# Altium schematic sheet ECAL-TEST-LEFT-ISOLATION.SchDoc
size A; SheetNumber: 2; SheetTotal: 5
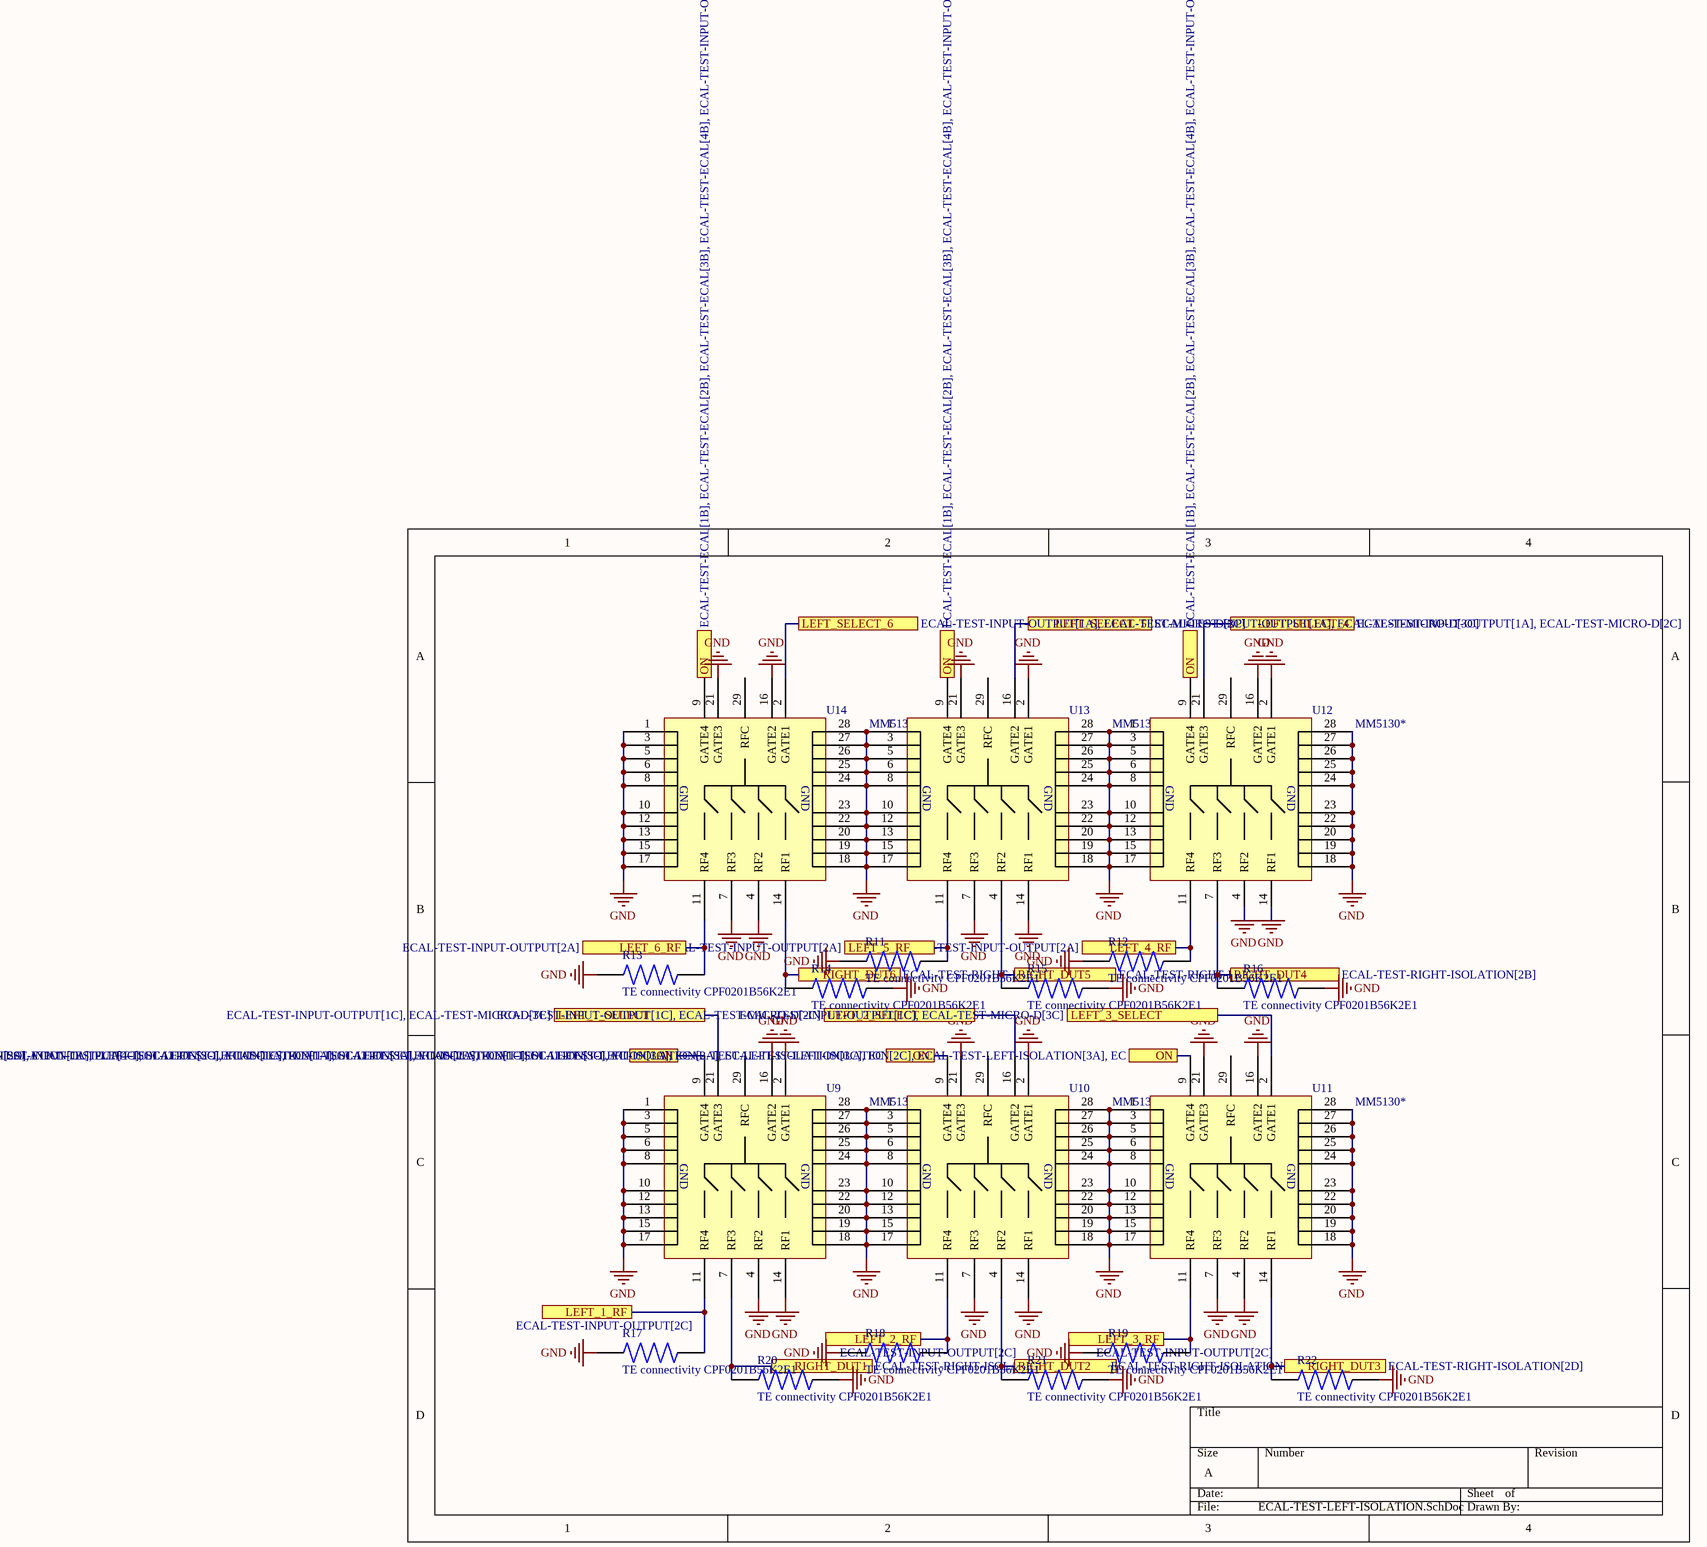
[diagram p0: ECAL-TEST-LEFT-ISOLATION.SchDoc]

## Parts
R11  TE connectivity CPF0201B56K2E1  [0201-resistor]
R12  TE connectivity CPF0201B56K2E1  [0201-resistor]
R13  TE connectivity CPF0201B56K2E1  [0201-resistor]
R14  TE connectivity CPF0201B56K2E1  [0201-resistor]
R15  TE connectivity CPF0201B56K2E1  [0201-resistor]
R16  TE connectivity CPF0201B56K2E1  [0201-resistor]
R17  TE connectivity CPF0201B56K2E1  [0201-resistor]
R18  TE connectivity CPF0201B56K2E1  [0201-resistor]
R19  TE connectivity CPF0201B56K2E1  [0201-resistor]
R20  TE connectivity CPF0201B56K2E1  [0201-resistor]
R21  TE connectivity CPF0201B56K2E1  [0201-resistor]
R22  TE connectivity CPF0201B56K2E1  [0201-resistor]
U9  MM5130*  [MM5130-NORM_PCB_NOFLOOD]
U10  MM5130*  [MM5130-NORM_PCB_NOFLOOD]
U11  MM5130*  [MM5130-NORM_PCB_NOFLOOD]
U12  MM5130*  [MM5130-NORM_PCB_NOFLOOD]
U13  MM5130*  [MM5130-NORM_PCB_NOFLOOD]
U14  MM5130*  [MM5130-NORM_PCB_NOFLOOD]

## Ports
LEFT_1_RF (see ECAL-TEST-INPUT-OUTPUT[2C]), LEFT_1_SELECT (see ECAL-TEST-INPUT-OUTPUT[1C], ECAL-TEST-MICRO-D[3C]), LEFT_2_RF (see ECAL-TEST-INPUT-OUTPUT[2C]), LEFT_2_SELECT (see ECAL-TEST-INPUT-OUTPUT[1C], ECAL-TEST-MICRO-D[2C]), LEFT_3_RF (see ECAL-TEST-INPUT-OUTPUT[2C]), LEFT_3_SELECT (see ECAL-TEST-INPUT-OUTPUT[1C], ECAL-TEST-MICRO-D[3C]), LEFT_4_RF (see ECAL-TEST-INPUT-OUTPUT[2A]), LEFT_5_RF (see ECAL-TEST-INPUT-OUTPUT[2A]), LEFT_6_RF (see ECAL-TEST-INPUT-OUTPUT[2A]), LEFT_SELECT_4 (see ECAL-TEST-INPUT-OUTPUT[1A], ECAL-TEST-MICRO-D[2C]), LEFT_SELECT_5 (see ECAL-TEST-INPUT-OUTPUT[1A], ECAL-TEST-MICRO-D[3C]), LEFT_SELECT_6 (see ECAL-TEST-INPUT-OUTPUT[1A], ECAL-TEST-MICRO-D[2C]), ON (see ECAL-TEST-ECAL[1B], ECAL-TEST-ECAL[2B], ECAL-TEST-ECAL[3B], ECAL-TEST-ECAL[4B], ECAL-TEST-INPUT-OUTPUT[1A], ECAL-TEST-INPUT-OUTPUT[1C], ECAL-TEST-INPUT-OUTPUT[2B], ECAL-TEST-INPUT-OUTPUT[3B], ECAL-TEST-INPUT-OUTPUT[4A], ECAL-TEST-INPUT-OUTPUT[4C], ECAL-TEST-LEFT-ISOLATION[1A], ECAL-TEST-LEFT-ISOLATION[1C], ECAL-TEST-LEFT-ISOLATION[2A], ECAL-TEST-LEFT-ISOLATION[2C], ECAL-TEST-LEFT-ISOLATION[3A], ECAL-TEST-MICRO-D[2C], ECAL-TEST-RIGHT-ISOLATION[2A], ECAL-TEST-RIGHT-ISOLATION[2C], ECAL-TEST-RIGHT-ISOLATION[3A], ECAL-TEST-RIGHT-ISOLATION[3C]), ON (see ECAL-TEST-ECAL[1B], ECAL-TEST-ECAL[2B], ECAL-TEST-ECAL[3B], ECAL-TEST-ECAL[4B], ECAL-TEST-INPUT-OUTPUT[1A], ECAL-TEST-INPUT-OUTPUT[1C], ECAL-TEST-INPUT-OUTPUT[2B], ECAL-TEST-INPUT-OUTPUT[3B], ECAL-TEST-INPUT-OUTPUT[4A], ECAL-TEST-INPUT-OUTPUT[4C], ECAL-TEST-LEFT-ISOLATION[1A], ECAL-TEST-LEFT-ISOLATION[1C], ECAL-TEST-LEFT-ISOLATION[2A], ECAL-TEST-LEFT-ISOLATION[2C], ECAL-TEST-LEFT-ISOLATION[3C], ECAL-TEST-MICRO-D[2C], ECAL-TEST-RIGHT-ISOLATION[2A], ECAL-TEST-RIGHT-ISOLATION[2C], ECAL-TEST-RIGHT-ISOLATION[3A], ECAL-TEST-RIGHT-ISOLATION[3C]), ON (see ECAL-TEST-ECAL[1B], ECAL-TEST-ECAL[2B], ECAL-TEST-ECAL[3B], ECAL-TEST-ECAL[4B], ECAL-TEST-INPUT-OUTPUT[1A], ECAL-TEST-INPUT-OUTPUT[1C], ECAL-TEST-INPUT-OUTPUT[2B], ECAL-TEST-INPUT-OUTPUT[3B], ECAL-TEST-INPUT-OUTPUT[4A], ECAL-TEST-INPUT-OUTPUT[4C], ECAL-TEST-LEFT-ISOLATION[1A], ECAL-TEST-LEFT-ISOLATION[1C], ECAL-TEST-LEFT-ISOLATION[2A], ECAL-TEST-LEFT-ISOLATION[3A], ECAL-TEST-LEFT-ISOLATION[3C], ECAL-TEST-MICRO-D[2C], ECAL-TEST-RIGHT-ISOLATION[2A], ECAL-TEST-RIGHT-ISOLATION[2C], ECAL-TEST-RIGHT-ISOLATION[3A], ECAL-TEST-RIGHT-ISOLATION[3C]), ON (see ECAL-TEST-ECAL[1B], ECAL-TEST-ECAL[2B], ECAL-TEST-ECAL[3B], ECAL-TEST-ECAL[4B], ECAL-TEST-INPUT-OUTPUT[1A], ECAL-TEST-INPUT-OUTPUT[1C], ECAL-TEST-INPUT-OUTPUT[2B], ECAL-TEST-INPUT-OUTPUT[3B], ECAL-TEST-INPUT-OUTPUT[4A], ECAL-TEST-INPUT-OUTPUT[4C], ECAL-TEST-LEFT-ISOLATION[1A], ECAL-TEST-LEFT-ISOLATION[1C], ECAL-TEST-LEFT-ISOLATION[2C], ECAL-TEST-LEFT-ISOLATION[3A], ECAL-TEST-LEFT-ISOLATION[3C], ECAL-TEST-MICRO-D[2C], ECAL-TEST-RIGHT-ISOLATION[2A], ECAL-TEST-RIGHT-ISOLATION[2C], ECAL-TEST-RIGHT-ISOLATION[3A], ECAL-TEST-RIGHT-ISOLATION[3C]), ON (see ECAL-TEST-ECAL[1B], ECAL-TEST-ECAL[2B], ECAL-TEST-ECAL[3B], ECAL-TEST-ECAL[4B], ECAL-TEST-INPUT-OUTPUT[1A], ECAL-TEST-INPUT-OUTPUT[1C], ECAL-TEST-INPUT-OUTPUT[2B], ECAL-TEST-INPUT-OUTPUT[3B], ECAL-TEST-INPUT-OUTPUT[4A], ECAL-TEST-INPUT-OUTPUT[4C], ECAL-TEST-LEFT-ISOLATION[1A], ECAL-TEST-LEFT-ISOLATION[2A], ECAL-TEST-LEFT-ISOLATION[2C], ECAL-TEST-LEFT-ISOLATION[3A], ECAL-TEST-LEFT-ISOLATION[3C], ECAL-TEST-MICRO-D[2C], ECAL-TEST-RIGHT-ISOLATION[2A], ECAL-TEST-RIGHT-ISOLATION[2C], ECAL-TEST-RIGHT-ISOLATION[3A], ECAL-TEST-RIGHT-ISOLATION[3C]), ON (see ECAL-TEST-ECAL[1B], ECAL-TEST-ECAL[2B], ECAL-TEST-ECAL[3B], ECAL-TEST-ECAL[4B], ECAL-TEST-INPUT-OUTPUT[1A], ECAL-TEST-INPUT-OUTPUT[1C], ECAL-TEST-INPUT-OUTPUT[2B], ECAL-TEST-INPUT-OUTPUT[3B], ECAL-TEST-INPUT-OUTPUT[4A], ECAL-TEST-INPUT-OUTPUT[4C], ECAL-TEST-LEFT-ISOLATION[1C], ECAL-TEST-LEFT-ISOLATION[2A], ECAL-TEST-LEFT-ISOLATION[2C], ECAL-TEST-LEFT-ISOLATION[3A], ECAL-TEST-LEFT-ISOLATION[3C], ECAL-TEST-MICRO-D[2C], ECAL-TEST-RIGHT-ISOLATION[2A], ECAL-TEST-RIGHT-ISOLATION[2C], ECAL-TEST-RIGHT-ISOLATION[3A], ECAL-TEST-RIGHT-ISOLATION[3C]), RIGHT_DUT1 (see ECAL-TEST-RIGHT-ISOLATION[3D]), RIGHT_DUT2 (see ECAL-TEST-RIGHT-ISOLATION[3D]), RIGHT_DUT3 (see ECAL-TEST-RIGHT-ISOLATION[2D]), RIGHT_DUT4 (see ECAL-TEST-RIGHT-ISOLATION[2B]), RIGHT_DUT5 (see ECAL-TEST-RIGHT-ISOLATION[3B]), RIGHT_DUT6 (see ECAL-TEST-RIGHT-ISOLATION[3B])

## Nets
GND: R11.1 R12.1 R13.1 R14.1 R15.1 R16.1 R17.1 R18.1 R19.1 R20.1 R21.1 R22.1 U9.1(GND) U9.2(GATE1) U9.3(GND) U9.4(RF2) U9.5(GND) U9.6(GND) U9.8(GND) U9.10(GND) U9.12(GND) U9.13(GND) U9.14(RF1) U9.15(GND) U9.16(GATE2) U9.17(GND) U9.18(GND) U9.19(GND) U9.20(GND) U9.22(GND) U9.23(GND) U9.24(GND) U9.25(GND) U9.26(GND) U9.27(GND) U9.28(GND) U10.1(GND) U10.2(GATE1) U10.3(GND) U10.5(GND) U10.6(GND) U10.7(RF3) U10.8(GND) U10.10(GND) U10.12(GND) U10.13(GND) U10.14(RF1) U10.15(GND) U10.17(GND) U10.18(GND) U10.19(GND) U10.20(GND) U10.21(GATE3) U10.22(GND) U10.23(GND) U10.24(GND) U10.25(GND) U10.26(GND) U10.27(GND) U10.28(GND) U11.1(GND) U11.3(GND) U11.4(RF2) U11.5(GND) U11.6(GND) U11.7(RF3) U11.8(GND) U11.10(GND) U11.12(GND) U11.13(GND) U11.15(GND) U11.16(GATE2) U11.17(GND) U11.18(GND) U11.19(GND) U11.20(GND) U11.21(GATE3) U11.22(GND) U11.23(GND) U11.24(GND) U11.25(GND) U11.26(GND) U11.27(GND) U11.28(GND) U12.1(GND) U12.2(GATE1) U12.3(GND) U12.4(RF2) U12.5(GND) U12.6(GND) U12.8(GND) U12.10(GND) U12.12(GND) U12.13(GND) U12.14(RF1) U12.15(GND) U12.16(GATE2) U12.17(GND) U12.18(GND) U12.19(GND) U12.20(GND) U12.22(GND) U12.23(GND) U12.24(GND) U12.25(GND) U12.26(GND) U12.27(GND) U12.28(GND) U13.1(GND) U13.2(GATE1) U13.3(GND) U13.5(GND) U13.6(GND) U13.7(RF3) U13.8(GND) U13.10(GND) U13.12(GND) U13.13(GND) U13.14(RF1) U13.15(GND) U13.17(GND) U13.18(GND) U13.19(GND) U13.20(GND) U13.21(GATE3) U13.22(GND) U13.23(GND) U13.24(GND) U13.25(GND) U13.26(GND) U13.27(GND) U13.28(GND) U14.1(GND) U14.3(GND) U14.4(RF2) U14.5(GND) U14.6(GND) U14.7(RF3) U14.8(GND) U14.10(GND) U14.12(GND) U14.13(GND) U14.15(GND) U14.16(GATE2) U14.17(GND) U14.18(GND) U14.19(GND) U14.20(GND) U14.21(GATE3) U14.22(GND) U14.23(GND) U14.24(GND) U14.25(GND) U14.26(GND) U14.27(GND) U14.28(GND)
LEFT_1_RF: R17.2 U9.11(RF4) ; port LEFT_1_RF
LEFT_1_SELECT: U9.21(GATE3) ; port LEFT_1_SELECT
LEFT_2_RF: R18.2 U10.11(RF4) ; port LEFT_2_RF
LEFT_2_SELECT: U10.16(GATE2) ; port LEFT_2_SELECT
LEFT_3_RF: R19.2 U11.11(RF4) ; port LEFT_3_RF
LEFT_3_SELECT: U11.2(GATE1) ; port LEFT_3_SELECT
LEFT_4_RF: R12.2 U12.11(RF4) ; port LEFT_4_RF
LEFT_5_RF: R11.2 U13.11(RF4) ; port LEFT_5_RF
LEFT_6_RF: R13.2 U14.11(RF4) ; port LEFT_6_RF
LEFT_SELECT_4: U12.21(GATE3) ; port LEFT_SELECT_4
LEFT_SELECT_5: U13.16(GATE2) ; port LEFT_SELECT_5
LEFT_SELECT_6: U14.2(GATE1) ; port LEFT_SELECT_6
ON: U9.9(GATE4) U10.9(GATE4) U11.9(GATE4) U12.9(GATE4) U13.9(GATE4) U14.9(GATE4) ; port ON
RIGHT_DUT1: R20.2 U9.7(RF3) ; port RIGHT_DUT1
RIGHT_DUT2: R21.2 U10.4(RF2) ; port RIGHT_DUT2
RIGHT_DUT3: R22.2 U11.14(RF1) ; port RIGHT_DUT3
RIGHT_DUT4: R16.2 U12.7(RF3) ; port RIGHT_DUT4
RIGHT_DUT5: R15.2 U13.4(RF2) ; port RIGHT_DUT5
RIGHT_DUT6: R14.2 U14.14(RF1) ; port RIGHT_DUT6

Not connected (* = marked no-connect by the designer): U9 29(RFC); U10 29(RFC); U11 29(RFC); U12 29(RFC); U13 29(RFC); U14 29(RFC)

## Library data of the parts
R11-R22 = TE connectivity CPF0201B56K2E1: CPF 0201 56K2 0.1% 25PPM 1K RL; MP: ERJ1GN0R00C; Value: 56k; Availability: Unavailable; Price: None; Package: None; Mfgr: TE connectivity; Mfgr Part No.: CPF0201B56K2E1
U9-U14 = IC-MM5130: High power SP4T MEMs switch